# EAGLE schematic lcd_booster_mk3 (EAGLE 6.1)
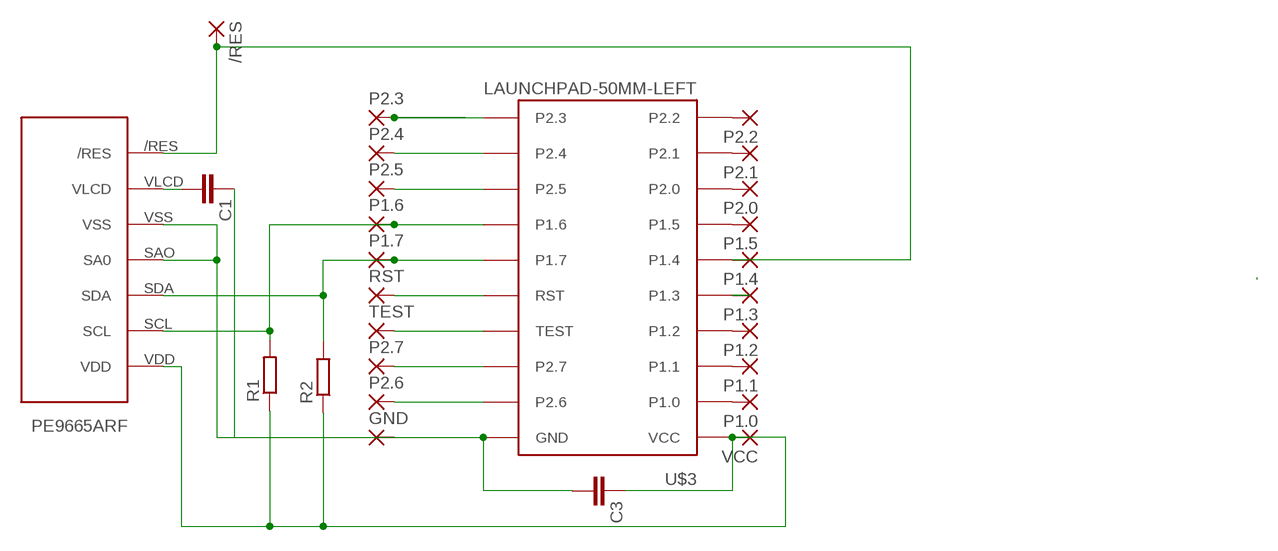
[diagram p0: schematic, sheet 1]

## Parts
/RES  1,6/0,9  [1,6/0,9]
C1  C-EUC1206  [C1206]
C3  C-EUC1206  [C1206]
GND  1,6/0,9  [1,6/0,9]
P1.0  1,6/0,9  [1,6/0,9]
P1.1  1,6/0,9  [1,6/0,9]
P1.2  1,6/0,9  [1,6/0,9]
P1.3  1,6/0,9  [1,6/0,9]
P1.4  1,6/0,9  [1,6/0,9]
P1.5  1,6/0,9  [1,6/0,9]
P1.6  1,6/0,9  [1,6/0,9]
P1.7  1,6/0,9  [1,6/0,9]
P2.0  SMD2  [SMD1,27-2,54]
P2.1  SMD2  [SMD1,27-2,54]
P2.2  1,6/0,9  [1,6/0,9]
P2.3  1,6/0,9  [1,6/0,9]
P2.4  SMD2  [SMD1,27-2,54]
P2.5  SMD2  [SMD1,27-2,54]
P2.6  1,6/0,9  [1,6/0,9]
P2.7  1,6/0,9  [1,6/0,9]
R1  R-EU_M1206  [M1206]
R2  R-EU_M1206  [M1206]
RST  1,6/0,9  [1,6/0,9]
TEST  1,6/0,9  [1,6/0,9]
U$2  PE9665ARF  [PE9665ARF]
U$3  LAUNCHPAD-50MM-LEFT  [LAUNCHPAD-50MM-LEFT]
VCC  1,6/0,9  [1,6/0,9]

## Nets
/RES: /RES.1(P) P1.4.1(P) U$2./RES U$3.P1.4
GND: C1.1 C3.2 GND.1(P) U$2.SAO(SA0) U$2.VSS U$3.GND
N$1: P2.2.1(P) U$3.P2.2
N$2: P1.3.1(P) U$3.P1.3
N$3: P1.0.1(P) U$3.P1.0
N$4: P2.1.1(P) U$3.P2.1
N$6: C1.2 U$2.VLCD
N$9: P2.0.1(P) U$3.P2.0
N$11: P1.5.1(P) U$3.P1.5
N$14: P1.2.1(P) U$3.P1.2
N$15: P1.1.1(P) U$3.P1.1
N$25: C3.1 R1.1 R2.1 U$2.VDD U$3.VCC VCC.1(P)
P1.6: P1.6.1(P) R1.2 U$2.SCL U$3.P1.6
P1.7: P1.7.1(P) R2.2 U$2.SDA U$3.P1.7
P2.3: P2.3.1(P) U$3.P2.3
P2.4: P2.4.1(P) U$3.P2.4
P2.5: P2.5.1(P) U$3.P2.5
P2.6: P2.6.1(P) U$3.P2.6
P2.7: P2.7.1(P) U$3.P2.7
RST: RST.1(P) U$3.RST
TEST: TEST.1(P) U$3.TEST

## Library data of the parts
/RES GND P1.0 P1.1-P1.7 P2.2 P2.3 P2.6 P2.7 RST TEST VCC = wirepad:1,6/0,9: THROUGH-HOLE PAD
C1 C3 = rcl:C-EU: CAPACITOR, European symbol
P2.0 P2.1 P2.4 P2.5 = wirepad:SMD2: SMD PAD
R1 R2 = resistor:R-EU_: RESISTOR, European symbol
U$2 = apus:PE9665ARF
U$3 = TI_launchpad:LAUNCHPAD: MSP-EXP430G2 LaunchPad Booster Pack layouts. LAUNCHPAD: Full-size board LAUNCHPAD-50MM: 50x50mm board covering the button area LAUNCHPAD-50MM-LEFT: 50x50mm board leaving the button area open. Tall LaunchPad components marked on Reference for reference.